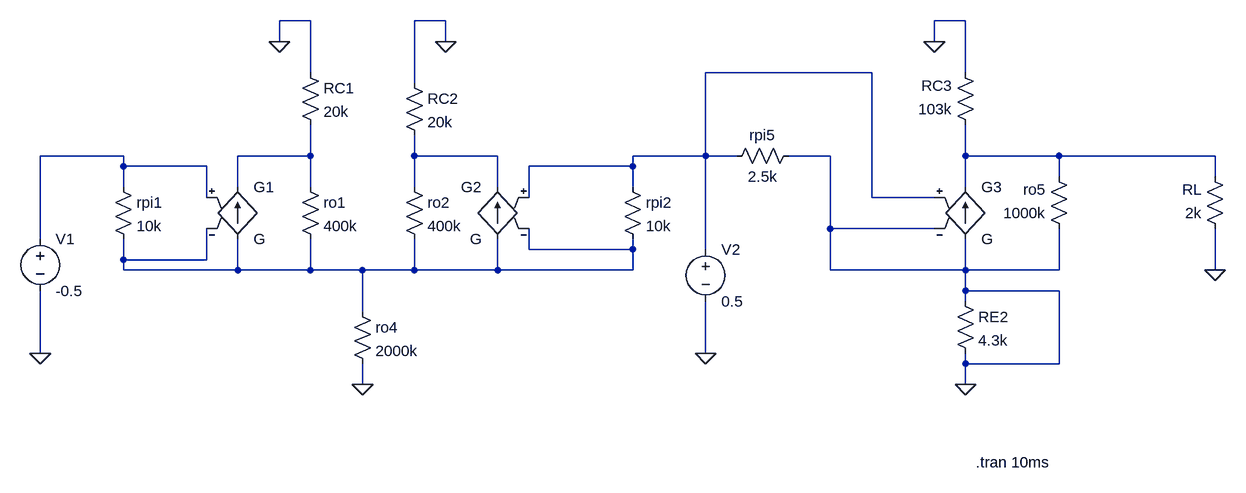
[diagram p0: schematic Draft1.asc]
Draft1.asc, the LTspice schematic file:
Version 4
SHEET 1 1908 728
WIRE 496 32 448 32
WIRE 704 32 656 32
WIRE 1504 32 1456 32
WIRE 448 64 448 32
WIRE 704 64 704 32
WIRE 1456 64 1456 32
WIRE 496 112 496 32
WIRE 1360 112 1104 112
WIRE 1504 112 1504 32
WIRE 656 128 656 32
WIRE 208 240 80 240
WIRE 496 240 496 192
WIRE 496 240 384 240
WIRE 656 240 656 208
WIRE 784 240 656 240
WIRE 1104 240 1104 112
WIRE 1104 240 992 240
WIRE 1152 240 1104 240
WIRE 1296 240 1232 240
WIRE 1504 240 1504 192
WIRE 1648 240 1504 240
WIRE 1888 240 1648 240
WIRE 208 256 208 240
WIRE 336 256 208 256
WIRE 992 256 992 240
WIRE 992 256 832 256
WIRE 1648 272 1648 240
WIRE 1888 272 1888 240
WIRE 208 288 208 256
WIRE 384 288 384 240
WIRE 496 288 496 240
WIRE 656 288 656 240
WIRE 784 288 784 240
WIRE 992 288 992 256
WIRE 1504 288 1504 240
WIRE 336 304 336 256
WIRE 832 304 832 256
WIRE 1360 304 1360 112
WIRE 1456 304 1360 304
WIRE 1296 352 1296 240
WIRE 1456 352 1296 352
WIRE 80 368 80 240
WIRE 832 384 832 352
WIRE 992 384 992 368
WIRE 992 384 832 384
WIRE 1104 384 1104 240
WIRE 208 400 208 368
WIRE 336 400 336 352
WIRE 336 400 208 400
WIRE 208 416 208 400
WIRE 384 416 384 368
WIRE 384 416 208 416
WIRE 496 416 496 368
WIRE 496 416 384 416
WIRE 576 416 496 416
WIRE 656 416 656 368
WIRE 656 416 576 416
WIRE 784 416 784 368
WIRE 784 416 656 416
WIRE 992 416 992 384
WIRE 992 416 784 416
WIRE 1296 416 1296 352
WIRE 1504 416 1504 368
WIRE 1504 416 1296 416
WIRE 1648 416 1648 352
WIRE 1648 416 1504 416
WIRE 1888 416 1888 352
WIRE 1504 448 1504 416
WIRE 1648 448 1504 448
WIRE 1504 464 1504 448
WIRE 576 480 576 416
WIRE 80 544 80 448
WIRE 1104 544 1104 464
WIRE 1504 560 1504 544
WIRE 1648 560 1648 448
WIRE 1648 560 1504 560
WIRE 576 592 576 560
WIRE 1504 592 1504 560
FLAG 80 544 0
FLAG 1888 416 0
FLAG 576 592 0
FLAG 448 64 0
FLAG 704 64 0
FLAG 1456 64 0
FLAG 1504 592 0
FLAG 1104 544 0
SYMBOL Res 480 96 R0
SYMATTR InstName RC1
SYMATTR Value 20k
SYMBOL Res 480 272 R0
SYMATTR InstName ro1
SYMATTR Value 400k
SYMBOL Res 192 272 R0
SYMATTR InstName rpi1
SYMATTR Value 10k
SYMBOL Res 560 464 R0
SYMATTR InstName ro4
SYMATTR Value 2000k
SYMBOL Res 640 272 R0
SYMATTR InstName ro2
SYMATTR Value 400k
SYMBOL Res 640 112 R0
SYMATTR InstName RC2
SYMATTR Value 20k
SYMBOL Res 976 272 R0
SYMATTR InstName rpi2
SYMATTR Value 10k
SYMBOL Res 1248 224 R90
WINDOW 0 0 56 VBottom 2
WINDOW 3 32 56 VTop 2
SYMATTR InstName rpi5
SYMATTR Value 2.5k
SYMBOL Res 1664 368 R180
WINDOW 0 36 76 Left 2
WINDOW 3 36 40 Left 2
SYMATTR InstName ro5
SYMATTR Value 1000k
SYMBOL Res 1904 368 R180
WINDOW 0 36 76 Left 2
WINDOW 3 36 40 Left 2
SYMATTR InstName RL
SYMATTR Value 2k
SYMBOL Res 1520 208 R180
WINDOW 0 36 76 Left 2
WINDOW 3 36 40 Left 2
SYMATTR InstName RC3
SYMATTR Value 103k
SYMBOL Res 1488 448 R0
SYMATTR InstName RE2
SYMATTR Value 4.3k
SYMBOL g 384 272 R0
SYMATTR InstName G1
SYMBOL g 784 272 M0
SYMATTR InstName G2
SYMBOL g 1504 272 R0
SYMATTR InstName G3
SYMBOL Voltage 80 352 R0
SYMATTR InstName V1
SYMATTR Value -0.5
SYMBOL Voltage 1104 368 R0
SYMATTR InstName V2
SYMATTR Value 0.5
TEXT 1520 712 Left 2 !.tran 10ms

The netlist it stands for:
* Draft1.asc
RC1 0 N003 20k
ro1 N003 N006 400k
rpi1 N002 N006 10k
ro4 N006 0 2000k
ro2 N004 N006 400k
RC2 0 N004 20k
rpi2 N001 N006 10k
rpi5 0 N001 2.5k
ro5 0 N005 1000k
RL 0 N005 2k
RC3 N005 0 103k
RE2 0 0 4.3k
G1 N006 N003 N002 N006 G
G2 N006 N004 N001 N006 G
G3 0 N005 N001 0 G
V1 N002 0 -0.5
V2 N001 0 0.5
.tran 10ms
.backanno
.end